# Altium schematic sheet main.SchDoc: Gesamtansicht
size A4; Author: Gerald Ebmer; DrawnBy: Gerald Ebmer; Engineer: Gerald Ebmer; Revision: 1.0; SheetNumber: 1; SheetTotal: 6; PageSetup: Record=PageOptions|CenterHorizontal=True|CenterVertical=True|PrintScale=1.00|XCorrection=1.00|YCorrection=1.00|PrintKind=0|BorderSize=5000000|LeftOffset=0|BottomOffset=0|Orientation=2|PaperLength=1000|PaperWidth=1000|Scale=100|PaperSource=7|PrintQuality=-3|MediaType=1|DitherType=10|PrintScaleMode=1|PaperKind=A4|PaperIndex=9
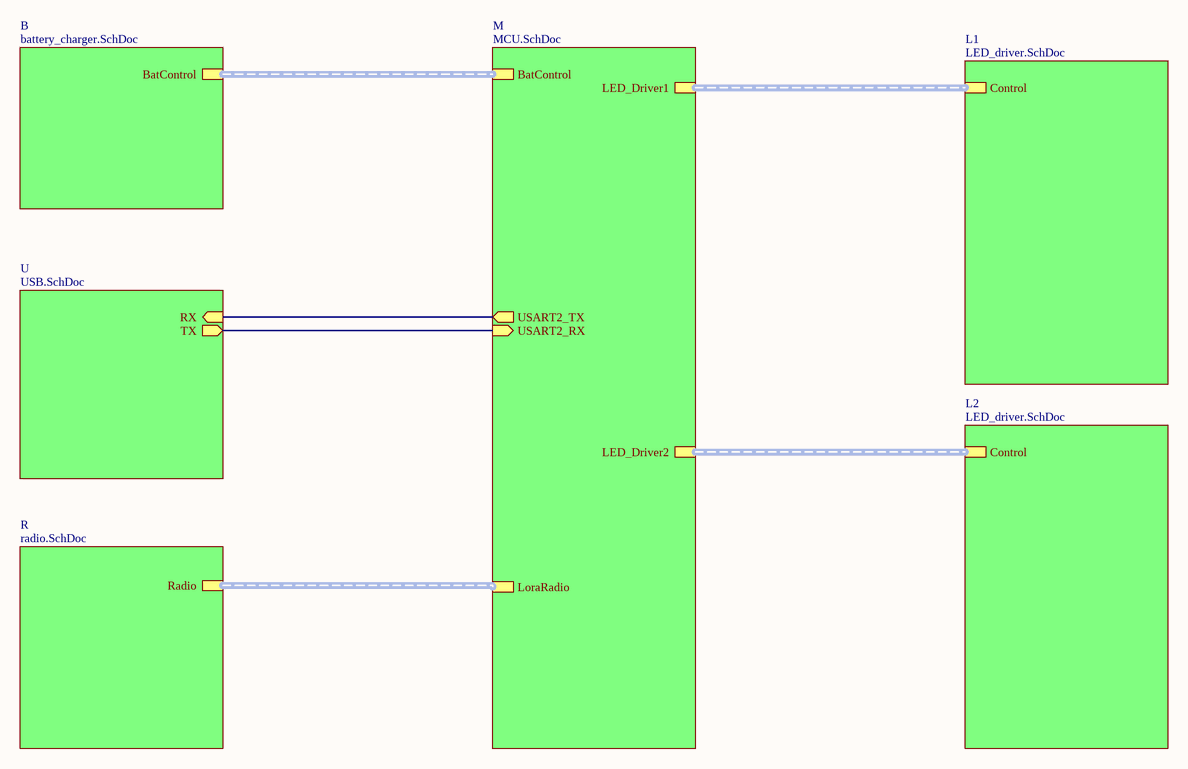
[diagram p0: main.SchDoc]

## Sub-sheets
B = battery_charger.SchDoc: BatControl (harness BatControl)
L1 = LED_driver.SchDoc: Control (harness LED_Driver)
L2 = LED_driver.SchDoc: Control (harness LED_Driver)
M = MCU.SchDoc: BatControl (harness BatControl), LED_Driver1 (harness LED_Driver), LED_Driver2 (harness LED_Driver), USART2_TX (out), USART2_RX (in), LoraRadio (harness Radio)
R = radio.SchDoc: Radio (harness Radio)
U = USB.SchDoc: RX (in), TX (out)

## Nets
(unnamed): sheet U/RX, sheet M/USART2_TX
(unnamed): sheet U/TX, sheet M/USART2_RX

## Buses and harness runs
harness sheet B/BatControl = sheet M/BatControl
harness sheet L1/Control = sheet M/LED_Driver1
harness sheet L2/Control = sheet M/LED_Driver2
harness sheet M/LoraRadio = sheet R/Radio

## Notes on the sheet
- Title
- Size:
- Date:
- A4
- Number:
- Time:
- Revision:
- Sheet
- of
- File: